# Altium schematic sheet ESP32DevKit-schematic-2.0.SchDoc
size 594 x 420 mm; SheetNumber: 1; SheetTotal: 1
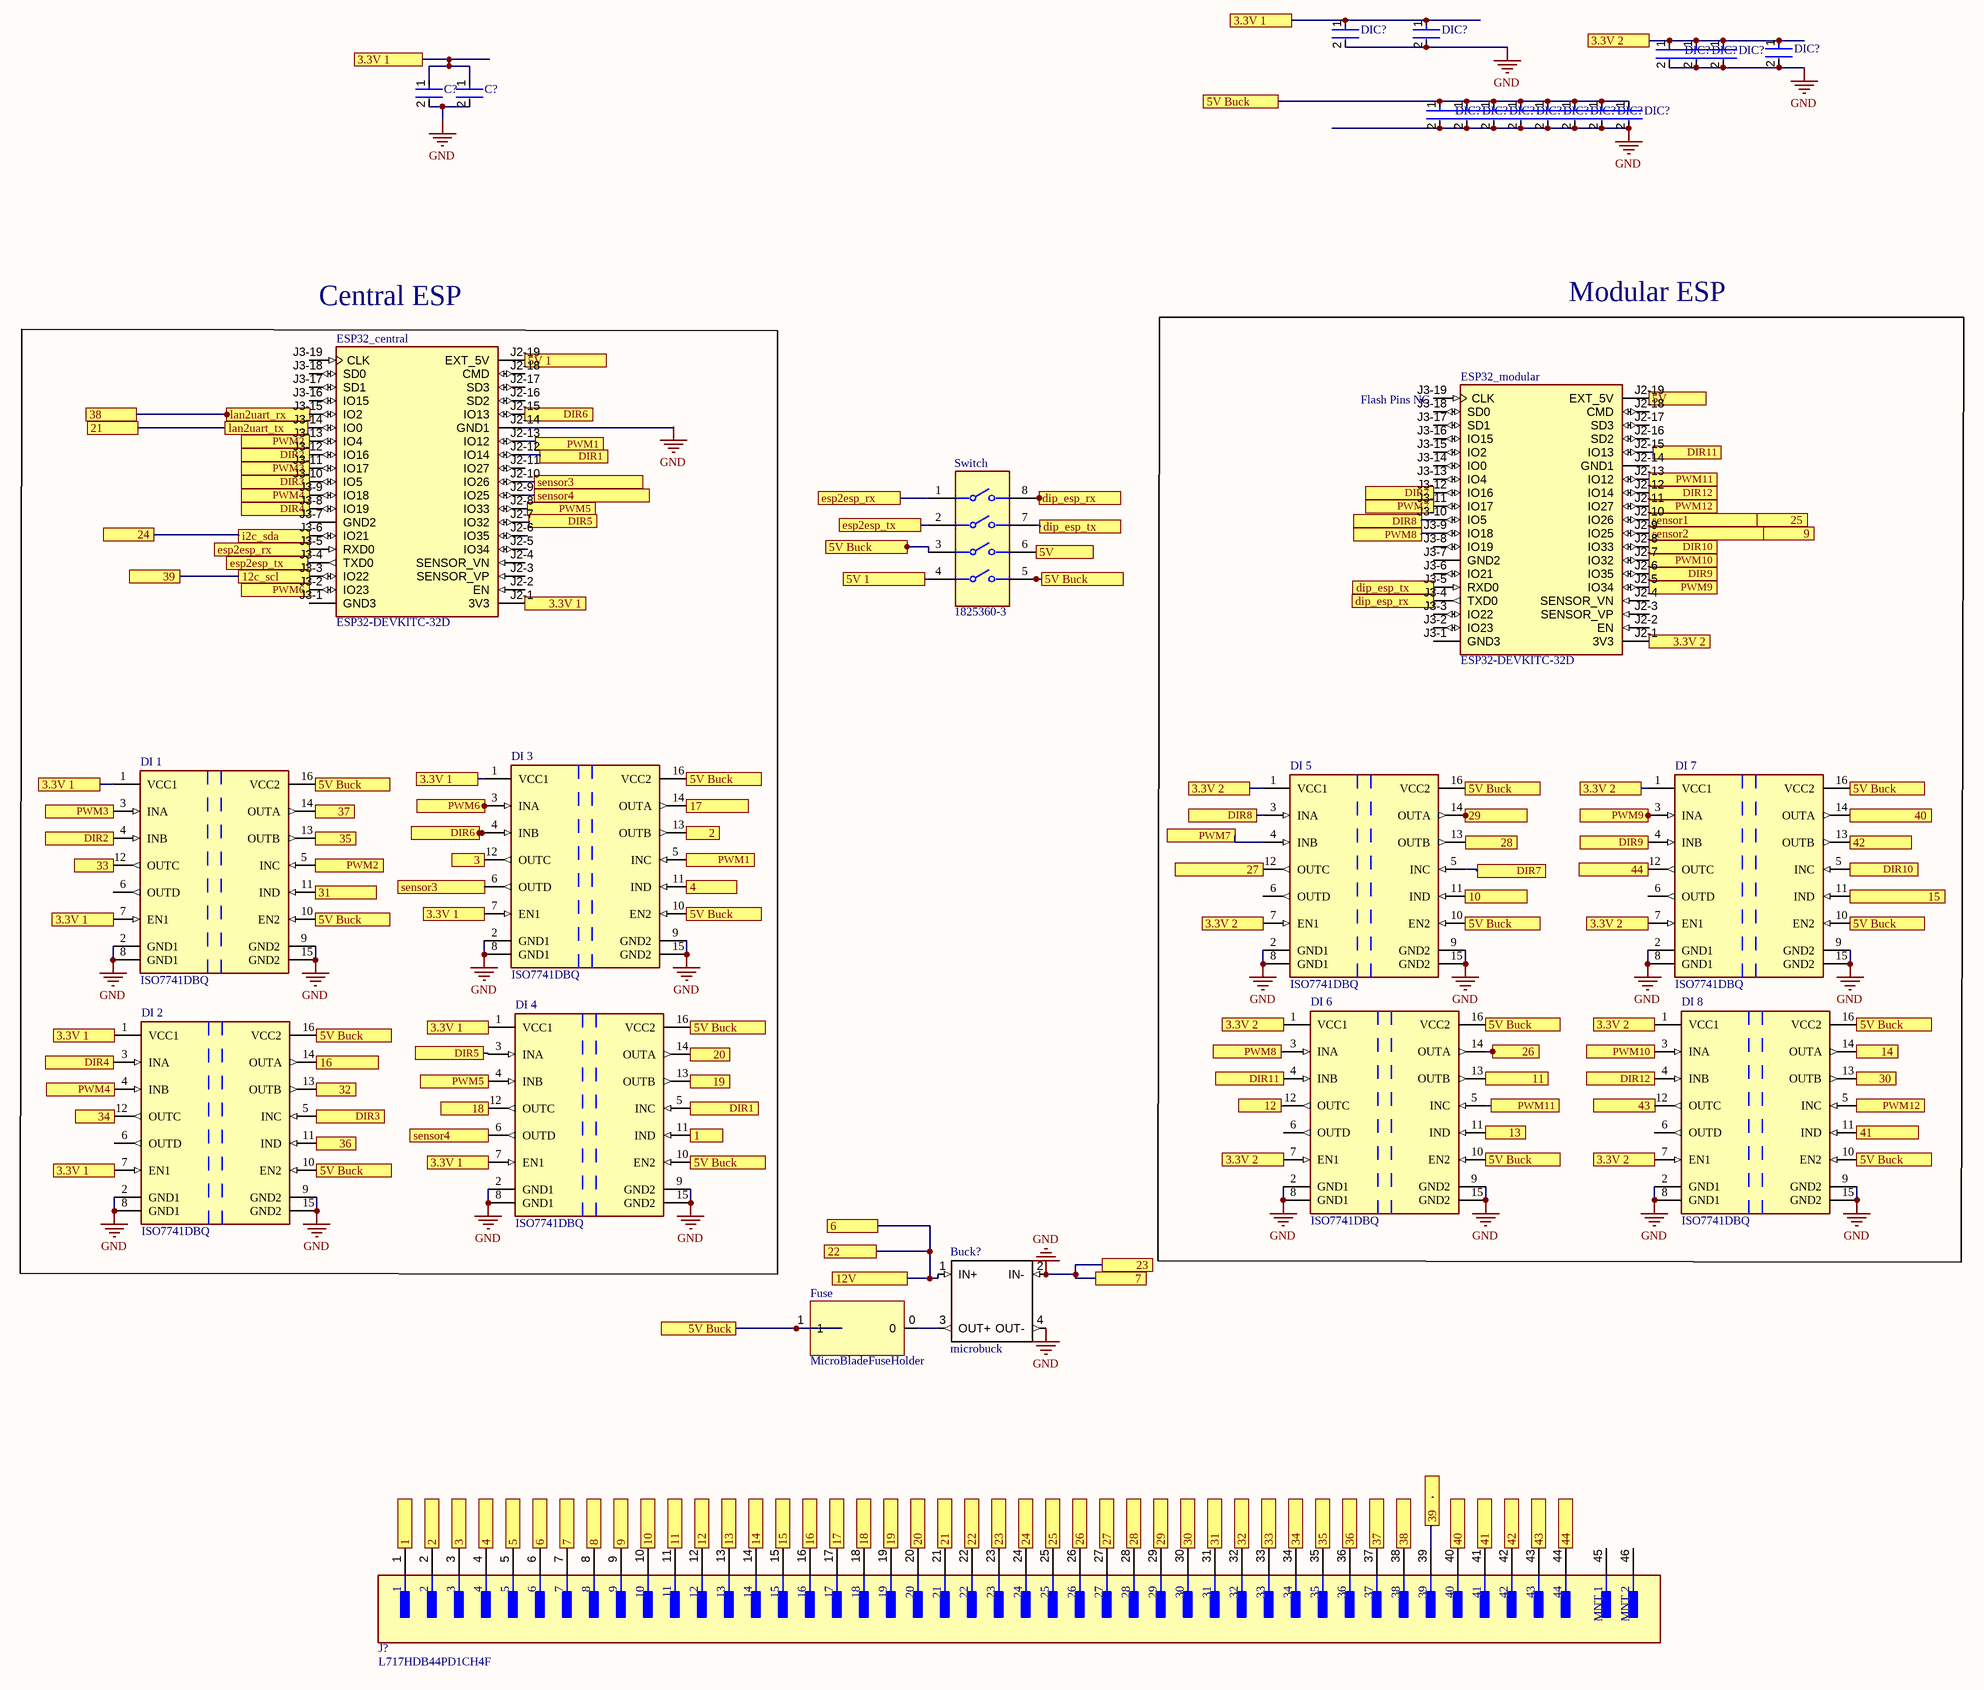
[diagram p0: ESP32DevKit-schematic-2.0.SchDoc]

## Parts
(Parts that share a designator on the sheet are numbered #1, #2 ... from top to bottom, then left to right.)
Buck?  microbuck  [Micro buck]
C?#1  C0603C104K5RACTU  [FP-C0603C-CF-MFG]  (value not drawn)
C?#2  C0805C106K8PACTU  [FP-C0805C-DG-MFG]  (value not drawn)
DI_1  ISO7741DBQ  [FP-DBQ0016A-MFG]
DI_2  ISO7741DBQ  [FP-DBQ0016A-MFG]
DI_3  ISO7741DBQ  [FP-DBQ0016A-MFG]
DI_4  ISO7741DBQ  [FP-DBQ0016A-MFG]
DI_5  ISO7741DBQ  [FP-DBQ0016A-MFG]
DI_6  ISO7741DBQ  [FP-DBQ0016A-MFG]
DI_7  ISO7741DBQ  [FP-DBQ0016A-MFG]
DI_8  ISO7741DBQ  [FP-DBQ0016A-MFG]
DIC?#1  C0603C104K5RACTU  [FP-C0603C-CF-MFG]  (value not drawn)
DIC?#2  C0603C104K5RACTU  [FP-C0603C-CF-MFG]  (value not drawn)
DIC?#3  C0603C104K5RACTU  [FP-C0603C-CF-MFG]  (value not drawn)
DIC?#4  C0603C104K5RACTU  [FP-C0603C-CF-MFG]  (value not drawn)
DIC?#5  C0603C104K5RACTU  [FP-C0603C-CF-MFG]  (value not drawn)
DIC?#6  C0603C104K5RACTU  [FP-C0603C-CF-MFG]  (value not drawn)
DIC?#7  C0603C104K5RACTU  [FP-C0603C-CF-MFG]  (value not drawn)
DIC?#8  C0603C104K5RACTU  [FP-C0603C-CF-MFG]  (value not drawn)
DIC?#9  C0603C104K5RACTU  [FP-C0603C-CF-MFG]  (value not drawn)
DIC?#10  C0603C104K5RACTU  [FP-C0603C-CF-MFG]  (value not drawn)
DIC?#11  C0603C104K5RACTU  [FP-C0603C-CF-MFG]  (value not drawn)
DIC?#12  C0603C104K5RACTU  [FP-C0603C-CF-MFG]  (value not drawn)
DIC?#13  C0603C104K5RACTU  [FP-C0603C-CF-MFG]  (value not drawn)
DIC?#14  C0603C104K5RACTU  [FP-C0603C-CF-MFG]  (value not drawn)
ESP32_central  ESP32-DEVKITC-32D  [MODULE_ESP32-DEVKITC-32D]
ESP32_modular  ESP32-DEVKITC-32D  [MODULE_ESP32-DEVKITC-32D]
Fuse  MicroBladeFuseHolder
J?  L717HDB44PD1CH4F  [FP-L717HDB44PD1CH4F-MFG]
Switch  1825360-3  [FP-1825360-3-MFG]

## Blocks framed on the sheet
Modular ESP: DI_5-DI_8 ESP32_modular
Central ESP: DI_1-DI_4 ESP32_central

## Ports
1, 2, 3, 3.3V 1, 3.3V 2, 4, 5, 5V, 5V 1, 5V Buck, 6, 7, 8, 9, 10, 11, 12, 12c_scl, 12V, 13, 14, 15, 16, 17, 18, 19, 20, 21, 22, 23, 24, 25, 26, 27, 28, 29, 30, 31, 32, 33, 34, 35, 36, 37, 38, 39, 40, 41, 42, 43, 44, dip_esp_rx, dip_esp_tx, DIR1, DIR2, DIR3, DIR4, DIR5, DIR6, DIR7, DIR8, DIR9, DIR10, DIR11, DIR12, esp2esp_rx, esp2esp_tx, i2c_sda, lan2uart_rx, lan2uart_tx, PWM1, PWM2, PWM3, PWM4, PWM5, PWM6, PWM7, PWM8, PWM9, PWM10, PWM11, PWM12, sensor1, sensor2, sensor3, sensor4

## Nets
GND: Buck?.2(IN-) Buck?.4(OUT-) C?#1.2 C?#2.2 DI_1.2(GND1) DI_1.8(GND1) DI_1.9(GND2) DI_1.15(GND2) DI_2.2(GND1) DI_2.8(GND1) DI_2.9(GND2) DI_2.15(GND2) DI_3.2(GND1) DI_3.8(GND1) DI_3.9(GND2) DI_3.15(GND2) DI_4.2(GND1) DI_4.8(GND1) DI_4.9(GND2) DI_4.15(GND2) DI_5.2(GND1) DI_5.8(GND1) DI_5.9(GND2) DI_5.15(GND2) DI_6.2(GND1) DI_6.8(GND1) DI_6.9(GND2) DI_6.15(GND2) DI_7.2(GND1) DI_7.8(GND1) DI_7.9(GND2) DI_7.15(GND2) DI_8.2(GND1) DI_8.8(GND1) DI_8.9(GND2) DI_8.15(GND2) DIC?#1.2 DIC?#2.2 DIC?#3.2 DIC?#4.2 DIC?#5.2 DIC?#6.2 DIC?#7.2 DIC?#8.2 DIC?#9.2 DIC?#10.2 DIC?#11.2 DIC?#12.2 DIC?#13.2 DIC?#14.2 ESP32_central.J2-14(GND1) J?.7 J?.23 ; port 7, port 23
1: DI_4.11(IND) J?.1 ; port 1
2: DI_3.13(OUTB) J?.2 ; port 2
3: DI_3.12(OUTC) J?.3 ; port 3
3.3V 1: C?#1.1 C?#2.1 DI_1.1(VCC1) DI_1.7(EN1) DI_2.1(VCC1) DI_2.7(EN1) DI_3.1(VCC1) DI_3.7(EN1) DI_4.1(VCC1) DI_4.7(EN1) DIC?#1.1 DIC?#2.1 ESP32_central.J2-1(3V3) ; port 3.3V 1
3.3V 2: DI_5.1(VCC1) DI_5.7(EN1) DI_6.1(VCC1) DI_6.7(EN1) DI_7.1(VCC1) DI_7.7(EN1) DI_8.1(VCC1) DI_8.7(EN1) DIC?#3.1 DIC?#4.1 DIC?#5.1 DIC?#6.1 ESP32_modular.J2-1(3V3) ; port 3.3V 2
4: DI_3.11(IND) J?.4 ; port 4
5: J?.5 ; port 5
5V: ESP32_modular.J2-19(EXT_5V) Switch.6 ; port 5V
5V 1: ESP32_central.J2-19(EXT_5V) Switch.4 ; port 5V 1
5V Buck: DI_1.10(EN2) DI_1.16(VCC2) DI_2.10(EN2) DI_2.16(VCC2) DI_3.10(EN2) DI_3.16(VCC2) DI_4.10(EN2) DI_4.16(VCC2) DI_5.10(EN2) DI_5.16(VCC2) DI_6.10(EN2) DI_6.16(VCC2) DI_7.10(EN2) DI_7.16(VCC2) DI_8.10(EN2) DI_8.16(VCC2) DIC?#7.1 DIC?#8.1 DIC?#9.1 DIC?#10.1 DIC?#11.1 DIC?#12.1 DIC?#13.1 DIC?#14.1 Fuse.1 Switch.3 Switch.5 ; port 5V Buck
8: J?.8 ; port 8
9: ESP32_modular.J2-9(IO25) J?.9 ; port 9, port sensor2
10: DI_5.11(IND) J?.10 ; port 10
11: DI_6.13(OUTB) J?.11 ; port 11
12: DI_6.12(OUTC) J?.12 ; port 12
12c_scl: ESP32_central.J3-3(IO22) J?.39 ; port 39, port 12c_scl
12V: Buck?.1(IN+) J?.6 J?.22 ; port 12V, port 6, port 22
13: DI_6.11(IND) J?.13 ; port 13
14: DI_8.14(OUTA) J?.14 ; port 14
15: DI_7.11(IND) J?.15 ; port 15
16: DI_2.14(OUTA) J?.16 ; port 16
17: DI_3.14(OUTA) J?.17 ; port 17
18: DI_4.12(OUTC) J?.18 ; port 18
19: DI_4.13(OUTB) J?.19 ; port 19
20: DI_4.14(OUTA) J?.20 ; port 20
21: ESP32_central.J3-14(IO0) J?.21 ; port 21, port lan2uart_tx
24: ESP32_central.J3-6(IO21) J?.24 ; port 24, port i2c_sda
25: ESP32_modular.J2-10(IO26) J?.25 ; port 25, port sensor1
26: DI_6.14(OUTA) J?.26 ; port 26
27: DI_5.12(OUTC) J?.27 ; port 27
28: DI_5.13(OUTB) J?.28 ; port 28
29: DI_5.14(OUTA) J?.29 ; port 29
30: DI_8.13(OUTB) J?.30 ; port 30
31: DI_1.11(IND) J?.31 ; port 31
32: DI_2.13(OUTB) J?.32 ; port 32
33: DI_1.12(OUTC) J?.33 ; port 33
34: DI_2.12(OUTC) J?.34 ; port 34
35: DI_1.13(OUTB) J?.35 ; port 35
36: DI_2.11(IND) J?.36 ; port 36
37: DI_1.14(OUTA) J?.37 ; port 37
38: ESP32_central.J3-15(IO2) J?.38 ; port 38, port lan2uart_rx
40: DI_7.14(OUTA) J?.40 ; port 40
41: DI_8.11(IND) J?.41 ; port 41
42: DI_7.13(OUTB) J?.42 ; port 42
43: DI_8.12(OUTC) J?.43 ; port 43
44: DI_7.12(OUTC) J?.44 ; port 44
dip_esp_rx: ESP32_modular.J3-4(TXD0) Switch.8 ; port dip_esp_rx
dip_esp_tx: ESP32_modular.J3-5(RXD0) Switch.7 ; port dip_esp_tx
DIR1: DI_4.5(INC) ESP32_central.J2-12(IO14) ; port DIR1
DIR2: DI_1.4(INB) ESP32_central.J3-12(IO16) ; port DIR2
DIR3: DI_2.5(INC) ESP32_central.J3-10(IO5) ; port DIR3
DIR4: DI_2.3(INA) ESP32_central.J3-8(IO19) ; port DIR4
DIR5: DI_4.3(INA) ESP32_central.J2-7(IO32) ; port DIR5
DIR6: DI_3.4(INB) ESP32_central.J2-15(IO13) ; port DIR6
DIR7: DI_5.5(INC) ESP32_modular.J3-12(IO16) ; port DIR7
DIR8: DI_5.3(INA) ESP32_modular.J3-10(IO5) ; port DIR8
DIR9: DI_7.4(INB) ESP32_modular.J2-6(IO35) ; port DIR9
DIR10: DI_7.5(INC) ESP32_modular.J2-8(IO33) ; port DIR10
DIR11: DI_6.4(INB) ESP32_modular.J2-15(IO13) ; port DIR11
DIR12: DI_8.4(INB) ESP32_modular.J2-12(IO14) ; port DIR12
esp2esp_rx: ESP32_central.J3-5(RXD0) Switch.1 ; port esp2esp_rx
esp2esp_tx: ESP32_central.J3-4(TXD0) Switch.2 ; port esp2esp_tx
PWM1: DI_3.5(INC) ESP32_central.J2-13(IO12) ; port PWM1
PWM2: DI_1.5(INC) ESP32_central.J3-13(IO4) ; port PWM2
PWM3: DI_1.3(INA) ESP32_central.J3-11(IO17) ; port PWM3
PWM4: DI_2.4(INB) ESP32_central.J3-9(IO18) ; port PWM4
PWM5: DI_4.4(INB) ESP32_central.J2-8(IO33) ; port PWM5
PWM6: DI_3.3(INA) ESP32_central.J3-2(IO23) ; port PWM6
PWM7: DI_5.4(INB) ESP32_modular.J3-11(IO17) ; port PWM7
PWM8: DI_6.3(INA) ESP32_modular.J3-9(IO18) ; port PWM8
PWM9: DI_7.3(INA) ESP32_modular.J2-5(IO34) ; port PWM9
PWM10: DI_8.3(INA) ESP32_modular.J2-7(IO32) ; port PWM10
PWM11: DI_6.5(INC) ESP32_modular.J2-13(IO12) ; port PWM11
PWM12: DI_8.5(INC) ESP32_modular.J2-11(IO27) ; port PWM12
sensor3: DI_3.6(OUTD) ESP32_central.J2-10(IO26) ; port sensor3
sensor4: DI_4.6(OUTD) ESP32_central.J2-9(IO25) ; port sensor4
NetBuck?_3: Buck?.3(OUT+) Fuse.0

Not connected (* = marked no-connect by the designer): DI_1 6(OUTD); DI_2 6(OUTD); DI_5 6(OUTD); DI_6 6(OUTD); DI_7 6(OUTD); DI_8 6(OUTD); ESP32_central J2-2(EN) J2-3(SENSOR_VP) J2-4(SENSOR_VN) J2-5(IO34) J2-6(IO35) J2-11(IO27) J2-16(SD2) J2-17(SD3) J2-18(CMD) J3-1(GND3) J3-7(GND2) J3-16(IO15) J3-17(SD1) J3-18(SD0) J3-19(CLK); ESP32_modular J2-2(EN) J2-3(SENSOR_VP) J2-4(SENSOR_VN) J2-14(GND1) J2-16(SD2) J2-17(SD3) J2-18(CMD) J3-1(GND3) J3-2(IO23) J3-3(IO22) J3-6(IO21) J3-7(GND2) J3-8(IO19) J3-13(IO4) J3-14(IO0) J3-15(IO2) J3-16(IO15) J3-17(SD1) J3-18(SD0) J3-19(CLK); J? 45(MNT_1) 46(MNT_2)

## Notes on the sheet
- (near ESP32_modular) Flash Pins NC
- DWG NO:
- REV:
- THIS DOCUMENT AND THE DATA DISCLOSED HEREIN OR
- HEREWITH IS THE PROPERTY OF ALTIUM LIMITED AND MAY
- BE FREELY DISTRIBUTED IN WHOLE. NO RIGHTS ARE
- RESERVED OR EXPRESS OR IMPLIED WARANTEE GIVEN.
- REVISION
- DESCRIPTION
- DATE
- APPROVED
- ENG:
- APPROVALS
- PROJECT
- DSN:
- CHK:
- REFERENCE DOCUMENTS
- PROJECT REVISION:
- TITLE
- DOCUMENT REVISION:
- DESIGN ITEM:
- BOM:
- FAB DWG:
- PCB DWG:
- ASSY DWG:
- SCALE:
- A2
- SIZE
- CAGE CODE
- FILE NAME
- DWG NO.
- SHEET
- OF
- REV

## Library data of the parts
C?#1 = CMP-2006-03061-2: CAP CER 0.1UF 50V X7R 0603; Manufacturer: KEMET; Tolerance: 0.1; Temperature Coefficient: 30ppm/°C; Material: Ceramic; Automotive Grade: Grade 1; Value: 0.10 μF; Temperature: -55°C to +125°C; RoHS: TRUE; Temperature Range High: +125°C; Lead Free: Yes; Octopart: https://octopart.com/c0603c104k5ractu-kemet-139244; Digikey Description: CAP CER 0.1UF 50V X7R 0603; Category: Cap; Package: C0603C-CF; ComponentLink2Description: Datasheet; Temperature Range Low: -55°C; Device Class L1: Passive Components; Voltage Rating: 50 V; Automotive: Yes; Device Class L3: Ceramic Capacitors; ComponentLink2URL: https://api.kemet.com/component-edge/download/datasheet/C0603C100J5GACAUTO.pdf; Capacitance: 0.10 μF; Device Class L2: Capacitors; Manufacturer Part Number: C0603C104K5RACTU; Temperature Characteristic: X7R; Height: 0.87mm
C?#2 = CMP-2007-03243-2: CAP CER 10UF 10V X5R 0805; Manufacturer: Kemet; 3DS Part Number: 220-00001; Tolerance: 10%; Temperature Coefficient: 15%; Material: Ceramic; Device Class L2: Capacitors; Device Class L1: Passive Components; ComponentLink2URL: https://content.kemet.com/datasheets/KEM_C1006_X5R_SMD.pdf; Height: 1.4mm; Lead Free: Yes; Manufacturer Part Number: C0805C106K8PACTU; Digikey Description: CAP CER 10UF 10V X5R 0805; Octopart: https://octopart.com/c0805c106k8pactu-kemet-98697; Capacitance: 10uF; Value: 10uF; Temperature Range Low: -55°C; Temperature: -55°C to +85°C; Automotive: No; Mouser Description: CAP CER 10UF 10V X5R 0805; Ipc Land Pattern Name: CAPC200125X125; Temperature Range High: +85°C; Voltage: 10V; RoHS: TRUE; Device Class L3: Ceramic Capacitors; ComponentLink2Description: Datasheet; Voltage Rating: 10V; Package: C0805C-DG; Temperature Characteristic: X5R; Category: Cap
DI_1-DI_8 = CMP-04872-000093-1: DGTL ISO 3000VRMS 4CH GP 16SSOP; Propagation Delay: 16ns; Channel Type: Unidirectional; Pulse Width Distortion (PWD): 4.9ns; Number of Channels: 4; Isolated Power: No; Data Rate: 100Mbps; Type: General Purpose; Max Operating Temperature: 125°C; Min Operating Temperature: -55°C; Packaging: Rail/Tube; RoHS Compliant: Yes; Mount: Surface Mount; Case/Package: SSOP
DIC?#1-DIC?#14 = CMP-2006-03061-2: CAP CER 0.1UF 50V X7R 0603; Manufacturer: KEMET; Tolerance: 0.1; Temperature Coefficient: 30ppm/°C; Automotive Grade: Grade 1; Value: 0.10 μF; Temperature: -55°C to +125°C; RoHS: TRUE; Material: Ceramic; Temperature Range High: +125°C; Lead Free: Yes; Octopart: https://octopart.com/c0603c104k5ractu-kemet-139244; Digikey Description: CAP CER 0.1UF 50V X7R 0603; Category: Cap; Package: C0603C-CF; ComponentLink2Description: Datasheet; Temperature Range Low: -55°C; Device Class L1: Passive Components; Voltage Rating: 50 V; Automotive: Yes; Device Class L3: Ceramic Capacitors; ComponentLink2URL: https://api.kemet.com/component-edge/download/datasheet/C0603C100J5GACAUTO.pdf; Capacitance: 0.10 μF; Device Class L2: Capacitors; Manufacturer Part Number: C0603C104K5RACTU; Temperature Characteristic: X7R; Height: 0.87mm
ESP32_central ESP32_modular = ESP32-DEVKITC-32D: WiFi Development Tools (802.11) ESP32 General Development Kit, ESP32-WROOM-32D on the board; MF: Espressif Systems; SnapEDA_Link: https://www.snapeda.com/parts/ESP32-DEVKITC-32D/Espressif+Systems/view-part/?ref=snap; Package: None; Value: *; MP: ESP32-DEVKITC-32D; Check_prices: https://www.snapeda.com/parts/ESP32-DEVKITC-32D/Espressif+Systems/view-part/?ref=eda
J? = CMP-02362-000001-1: CONN DSUB HD PLUG 44POS R/A SLDR; Current Rating: 3A; Body Material: Steel; Number of Contacts: 44; Connector Type: D-Sub; Number of Ports: 1; Gender: Male; Voltage Rating: 250V; Width: 12.55mm; Contact Plating: Gold; Max Operating Temperature: 105°C; Number of Terminals: 44; Length: 53.09mm; Number of Rows: 3; Number of Positions: 44; Min Operating Temperature: -55°C; Orientation: Right Angle; Packaging: Tray; Package Quantity: 50; Termination: Solder; Depth: 22.22mm; Housing Material: Thermoplastic; Mount: Through Hole; Contact Material: Brass
Switch = CMP-03400-000022-1: SWITCH SLIDE DIP SPST 100MA 24V; Washable: Yes; Contact Current Rating: 1A; Electrical Life: 1000Cycles; Number of Circuits: 4; Pitch: 0.1inch; Actuator Length: 0.99mm; Contact Resistance: 50mR; Actuator Type: Standard; Contact Post Length: 4mm; Voltage Rating (DC): 5V; Actuator Material: Polybutylene; Sealable: No (Without); Max Voltage Rating (DC): 24V; Throw Configuration: SPST; Mount: Through Hole; Type: Switch; RoHS Compliant: Yes; Min Operating Temperature: -30°C; Max Operating Temperature: 85°C; Orientation: Straight; Packaging: Rail/Tube; Series: ADE; Lead Free: Lead Free; Depth: 7.49mm; Flammability Rating: UL94 V-0; Radiation Hardening: No; Terminal Pitch: 2.54mm; Package Quantity: 35; Contact Material: Copper Alloy; Housing Color: Black; Number of Positions: 4; Length: 0.476inch; ELV: Compliant; Termination: PC Pins; Housing Material: Polyphenylene; Contact Plating: Gold; Max Current Rating: 100mA; Height: 0.138inch